# EAGLE schematic Electronic Cricket (EAGLE 9.6.2)
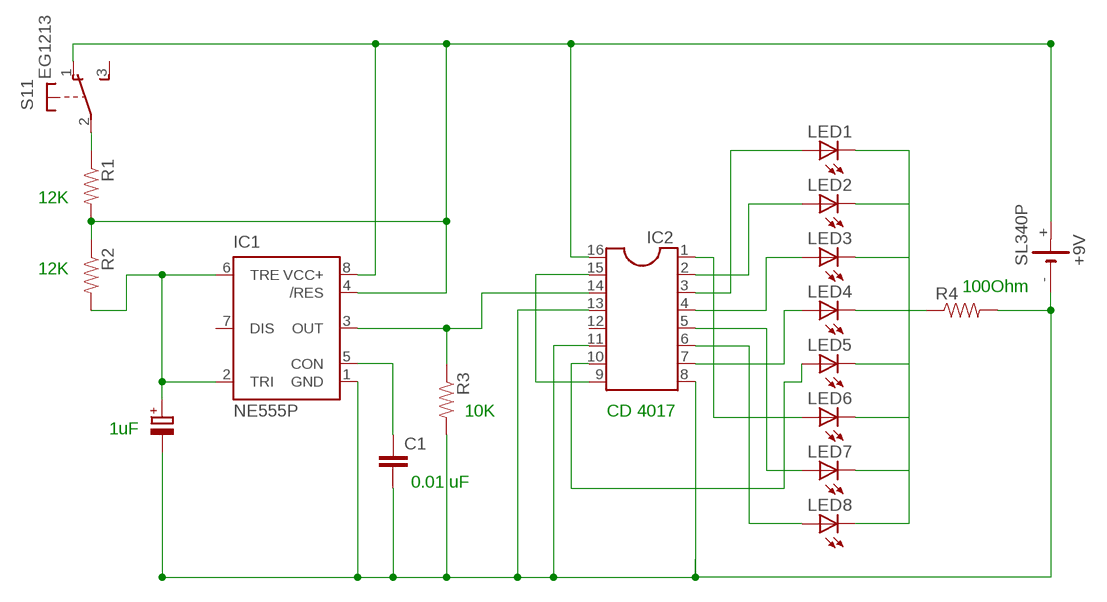
[diagram p0: schematic, sheet 1]

## Parts
+9V  SL340P  [SL-340/P3.6V]
C1  C2.5/6  [C2.5-6]
IC1  NE555P  [DIL-08]
IC2  DIL16  [DIL16]
LED1  LEDB156  [Q62902-B156]
LED2  LEDB156  [Q62902-B156]
LED3  LEDB156  [Q62902-B156]
LED4  LEDB156  [Q62902-B156]
LED5  LEDB156  [Q62902-B156]
LED6  LEDB156  [Q62902-B156]
LED7  LEDB156  [Q62902-B156]
LED8  LEDB156  [Q62902-B156]
R1  RESISTORAXIAL-0.3  [AXIAL-0.3]
R2  RESISTORAXIAL-0.3  [AXIAL-0.3]
R3  RESISTORAXIAL-0.3  [AXIAL-0.3]
R4  RESISTORAXIAL-0.3  [AXIAL-0.3]
S1  EG1213  [EG1213]

## Nets
N$1: IC2.3 LED1.A
N$2: IC2.2 LED2.A
N$3: IC2.4 LED3.A
N$4: IC2.7 LED4.A
N$5: IC2.10 LED5.A
N$6: IC2.1 LED6.A
N$7: IC2.5 LED7.A
N$8: IC2.9 IC2.15
N$9: +9V.- C1.2 IC1.1(GND) IC2.8 IC2.11 IC2.13 R3.P$2 R4.P$2
N$10: IC2.6 LED8.A
N$11: R1.P$1 S1.2(1:P)
N$13: LED1.K(C) LED2.K(C) LED3.K(C) LED4.K(C) LED5.K(C) LED6.K(C) LED7.K(C) LED8.K(C) R4.P$1
N$14: IC1.3(OUT) IC2.14 R3.P$1
N$18: +9V.+ IC1.4(/RES) IC1.8(VCC+) IC2.16 R1.P$2 R2.P$1 S1.1(1:O)
N$19: IC1.2(TRI) IC1.6(TRE) R2.P$2
N$21: C1.1 IC1.5(CON)
Unconnected: IC1.7(DIS) IC2.12 S1.3(1:S) S1.MT1(MT) S1.MT2(MT)

## Notes on the sheet
- 12K
- 12K
- 100Ohm
- 10K | CD 4017
- 1uF
- 0.01 uF

## Library data of the parts
+9V = battery:SL340P: LI BATTERY Sonnenschein SL-340 P 3.6 V
C1 = capacitor-wima:C: CAPACITOR naming: grid - package width
IC1 = SparkFun-AnalogIC:NE555: General purpose bipolar Timer; MF: Arrow Electronics; MPN: NE555N; OC_FARNELL: 1467742; OC_NEWARK: 89K1486
IC2 = ic-package:DIL16: Dual In Line / Socket
LED1-LED8 = led:LED: LED OSRAM: - CHIPLED LG R971, LG N971, LY N971, LG Q971, LY Q971, LO R971, LY R971 LH N974, LH R974 LS Q976, LO Q976, LY Q976 LO Q996 - Hyper CHIPLED LW Q18S LB Q993, LB Q99A, LB R99A - SideLED LS A670, LO A670, LY A670, LG A670, LP A670 LB A673, LV A673, LT A673, LW A673 LH A674 LY A675 LS A676, LA A676, LO A676, LY A676, LW A676 LS A679, LY A679, LG A679 - Hyper Micro SIDELED® LS Y876, LA Y876, LO Y876, LY Y876 LT Y87S - SmartLED LW L88C, LW L88S LB L89C, LB L89S, LG L890 LS L89K, LO L89K, LY L89K LS L896, LA L896, LO L896, LY L896 - TOPLED LS T670, LO T670, LY T670, LG T670, LP T670 LSG T670, LSP T670, LSY T670, LOP T670, LYG T670 LG T671, LOG T671, LSG T671 LB T673, LV T673, LT T673, LW T673 LH T674 LS T676, LA T676, LO T676, LY T676, LB T676, LH T676, LSB T676, LW T676 LB T67C, LV T67C, LT T67C, LS T67K, LO T67K, LY T67K, LW E67C LS E67B, LA E67B, LO E67B, LY E67B, LB E67C, LV E67C, LT E67C LW T67C LS T679, LY T679, LG T679 LS T770, LO T770, LY T770, LG T770, LP T770 LB T773, LV T773, LT T773, LW T773 LH T774 LS E675, LA E675, LY E675, LS T675 LS T776, LA T776, LO T776, LY T776, LB T776 LHGB T686 LT T68C, LB T68C - Hyper Mini TOPLED® LB M676 - Mini TOPLED Santana® LG M470 LS M47K, LO M47K, LY M47K Source: http://www.osram.convergy.de LUXEON: - LUMILED® LXK2-PW12-R00, LXK2-PW12-S00, LXK2-PW14-U00, LXK2-PW14-V00 LXK2-PM12-R00, LXK2-PM12-S00, LXK2-PM14-U00 LXK2-PE12-Q00, LXK2-PE12-R00, LXK2-PE12-S00, LXK2-PE14-T00, LXK2-PE14-U00 LXK2-PB12-K00, LXK2-PB12-L00, LXK2-PB12-M00, LXK2-PB14-N00, LXK2-PB14-P00, LXK2-PB14-Q00 LXK2-PR12-L00, LXK2-PR12-M00, LXK2-PR14-Q00, LXK2-PR14-R00 LXK2-PD12-Q00, LXK2-PD12-R00, LXK2-PD12-S00 LXK2-PH12-R00, LXK2-PH12-S00 LXK2-PL12-P00, LXK2-PL12-Q00, LXK2-PL12-R00 Source: www.luxeon.com KINGBRIGHT: KA-3528ASYC Source: www.kingbright.com
R1-R4 = SparkFun-Passives:RESISTOR: Resistor Basic schematic elements and footprints for 0603, 1206, and PTH resistors.
S1 = adafruit:EG1213: E-Switch right-angle slide SPDT Part #EG1213 http://www.ladyada.net/library/eagle